# Altium schematic sheet Sub_a.SchDoc
size A; SheetNumber: 1; SheetTotal: 6
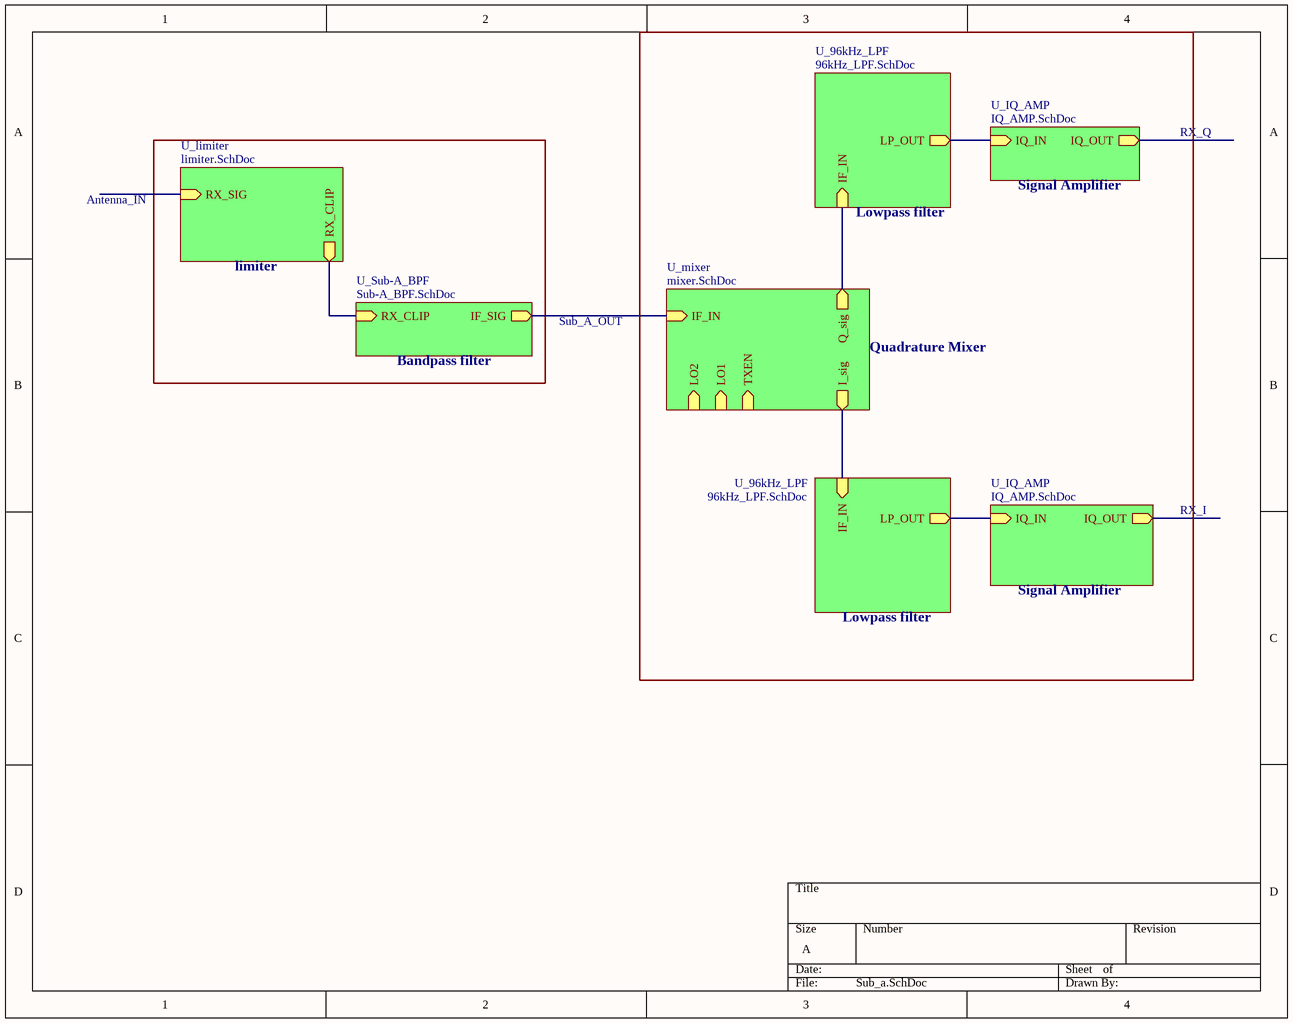
[diagram p0: Sub_a.SchDoc]

## Sub-sheets
U_96kHz_LPF = 96kHz_LPF.SchDoc: IF_IN (in), LP_OUT (out)
U_96kHz_LPF = 96kHz_LPF.SchDoc: IF_IN (in), LP_OUT (out)
U_IQ_AMP = IQ_AMP.SchDoc: IQ_IN (in), IQ_OUT (out)
U_IQ_AMP = IQ_AMP.SchDoc: IQ_IN (in), IQ_OUT (out)
U_limiter = limiter.SchDoc: RX_SIG (in), RX_CLIP (out)
U_mixer = mixer.SchDoc: Q_sig (out), I_sig (out), TXEN (in), LO2 (in), LO1 (in), IF_IN (in)
U_Sub-A_BPF = Sub-A_BPF.SchDoc: IF_SIG (out), RX_CLIP (in)

## Nets
(unnamed): sheet U_limiter/RX_CLIP, sheet U_Sub-A_BPF/RX_CLIP
(unnamed): sheet U_Sub-A_BPF/IF_SIG, sheet U_mixer/IF_IN
(unnamed): sheet U_96kHz_LPF/IF_IN, sheet U_mixer/Q_sig
(unnamed): sheet U_96kHz_LPF/LP_OUT, sheet U_IQ_AMP/IQ_IN
(unnamed): sheet U_96kHz_LPF/IF_IN, sheet U_mixer/I_sig
(unnamed): sheet U_96kHz_LPF/LP_OUT, sheet U_IQ_AMP/IQ_IN

## Notes on the sheet
- RX_Q
- Antenna_IN
- Lowpass filter
- Signal Amplifier
- limiter
- Bandpass filter
- Sub_A_OUT
- Quadrature Mixer
- RX_I